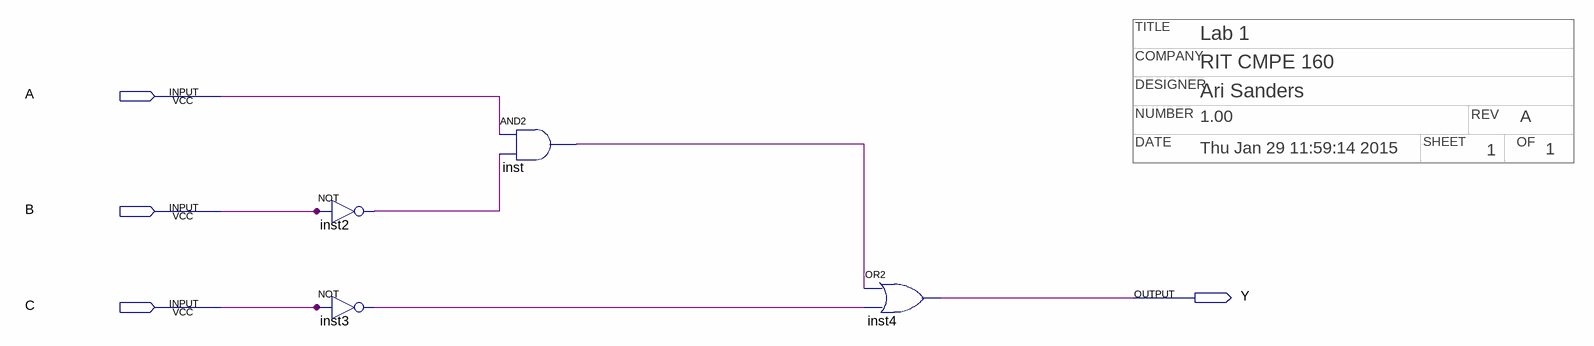
[diagram p0: schematic sheet]
// Quartus schematic Lab1.bdf as structural Verilog: 4 symbols, 4 pins
// Title block: COMPANY: RIT CMPE 160; DATE: Thu Jan 29 11:59:14 2015; DESIGNER: Ari Sanders; NUMBER: 1.00; OF: 1; REV: A; SHEET: 1; TITLE: Lab 1
module Lab1 (
  input  A,
  input  B,
  input  C,
  output Y
);

  wire inst2_out, inst3_out, inst_out;

  not inst2 (inst2_out, B);
  not inst3 (inst3_out, C);
  and inst (inst_out, A, inst2_out);
  or inst4 (Y, inst_out, inst3_out);
endmodule
